# EAGLE design blinkyBoard (EAGLE 9.6.2)
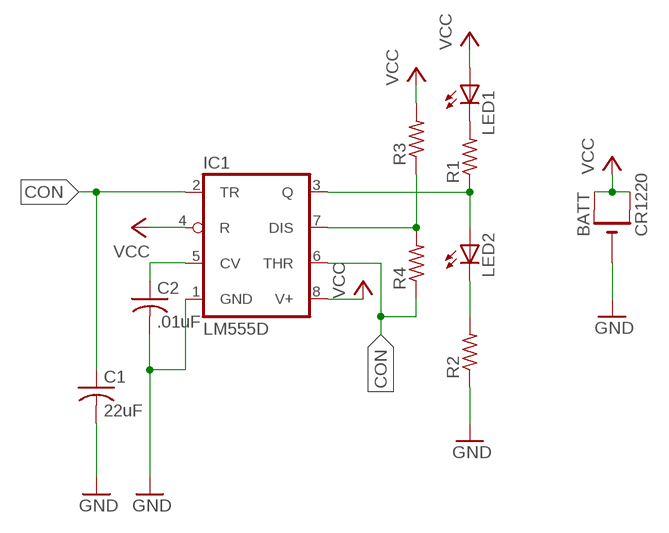
[diagram p0: schematic, sheet 1]

## Parts
BATT  CR1220  CR1220SMT  [CR1220-SMD]
C1  22uF  C-USC0805  [C0805]
C2  .01uF  C-USC0805  [C0805]
IC1  LM555D  [SO08]
LED1  LEDCHIP-LED0805  [CHIP-LED0805]
LED2  LEDCHIP-LED0805  [CHIP-LED0805]
R1  R-US_R0805  [R0805]
R2  R-US_R0805  [R0805]
R3  R-US_R0805  [R0805]
R4  R-US_R0805  [R0805]

## Nets
CON: C1.1 IC1.2(TR) IC1.6(THR) R4.1
GND: BATT.- C1.2 C2.2 IC1.1(GND) R2.1
N$1: LED1.C R1.2
N$2: IC1.3(Q) LED2.A R1.1
N$3: LED2.C R2.2
N$6: IC1.7(DIS) R3.1 R4.2
N$7: C2.1 IC1.5(CV)
VCC: BATT.+$1(+) BATT.+$2(+1) IC1.4(R) IC1.8(V+) LED1.A R3.2

## Library data of the parts
BATT = adafruit:CR1220: CR1216/CR1220/CR1225 12mm 3V lithium coin cell Great for battery packup. Both SMT and THM holders. Note the THM package has the ground pads on both sides of the PCB so that the masks are the same - this reduces the cost; MF: HARWIN; MPN: S8201-46R; OC_NEWARK: 65T3841
C1 = adafruit:C-US: CAPACITOR, American symbol; MF: MURATA; MPN: GRM21BR60J226ME39L; OC_NEWARK: 03AC2714
C2 = adafruit:C-US: CAPACITOR, American symbol; MF: KEMET; MPN: C0805C103K5RACTU; OC_NEWARK: 01J3314
IC1 = adafruit:*555: TIMER Changed DIP package to have round (not oval) pin pads http://www.ladyada.net/library/pcb/eaglelibrary.html; MF: TEXAS INSTRUMENTS; MPN: TLC555CD; OC_NEWARK: 29AH7834
LED1 LED2 = adafruit:LED: LED OSRAM: - CHIPLED LG R971, LG N971, LY N971, LG Q971, LY Q971, LO R971, LY R971 LH N974, LH R974 LS Q976, LO Q976, LY Q976 LO Q996 - Hyper CHIPLED LW Q18S LB Q993, LB Q99A, LB R99A - SideLED LS A670, LO A670, LY A670, LG A670, LP A670 LB A673, LV A673, LT A673, LW A673 LH A674 LY A675 LS A676, LA A676, LO A676, LY A676, LW A676 LS A679, LY A679, LG A679 - Hyper Micro SIDELED® LS Y876, LA Y876, LO Y876, LY Y876 LT Y87S - SmartLED LW L88C, LW L88S LB L89C, LB L89S, LG L890 LS L89K, LO L89K, LY L89K LS L896, LA L896, LO L896, LY L896 - TOPLED LS T670, LO T670, LY T670, LG T670, LP T670 LSG T670, LSP T670, LSY T670, LOP T670, LYG T670 LG T671, LOG T671, LSG T671 LB T673, LV T673, LT T673, LW T673 LH T674 LS T676, LA T676, LO T676, LY T676, LB T676, LH T676, LSB T676, LW T676 LB T67C, LV T67C, LT T67C, LS T67K, LO T67K, LY T67K, LW E67C LS E67B, LA E67B, LO E67B, LY E67B, LB E67C, LV E67C, LT E67C LW T67C LS T679, LY T679, LG T679 LS T770, LO T770, LY T770, LG T770, LP T770 LB T773, LV T773, LT T773, LW T773 LH T774 LS E675, LA E675, LY E675, LS T675 LS T776, LA T776, LO T776, LY T776, LB T776 LHGB T686 LT T68C, LB T68C - Hyper Mini TOPLED® LB M676 - Mini TOPLED Santana® LG M470 LS M47K, LO M47K, LY M47K Source: http://www.osram.convergy.de/; MF: LUMEX; MPN: SML-LX0805SGC-TR; OC_NEWARK: 09J9651
R1-R4 = adafruit:R-US_: RESISTOR, American symbol; MF: VISHAY; MPN: CRCW0805100RJNEA; OC_NEWARK: 01H7765

## Net classes
0 default: width 0.305 mm, drill 0.508 mm, clearance 0.254 mm

## Board
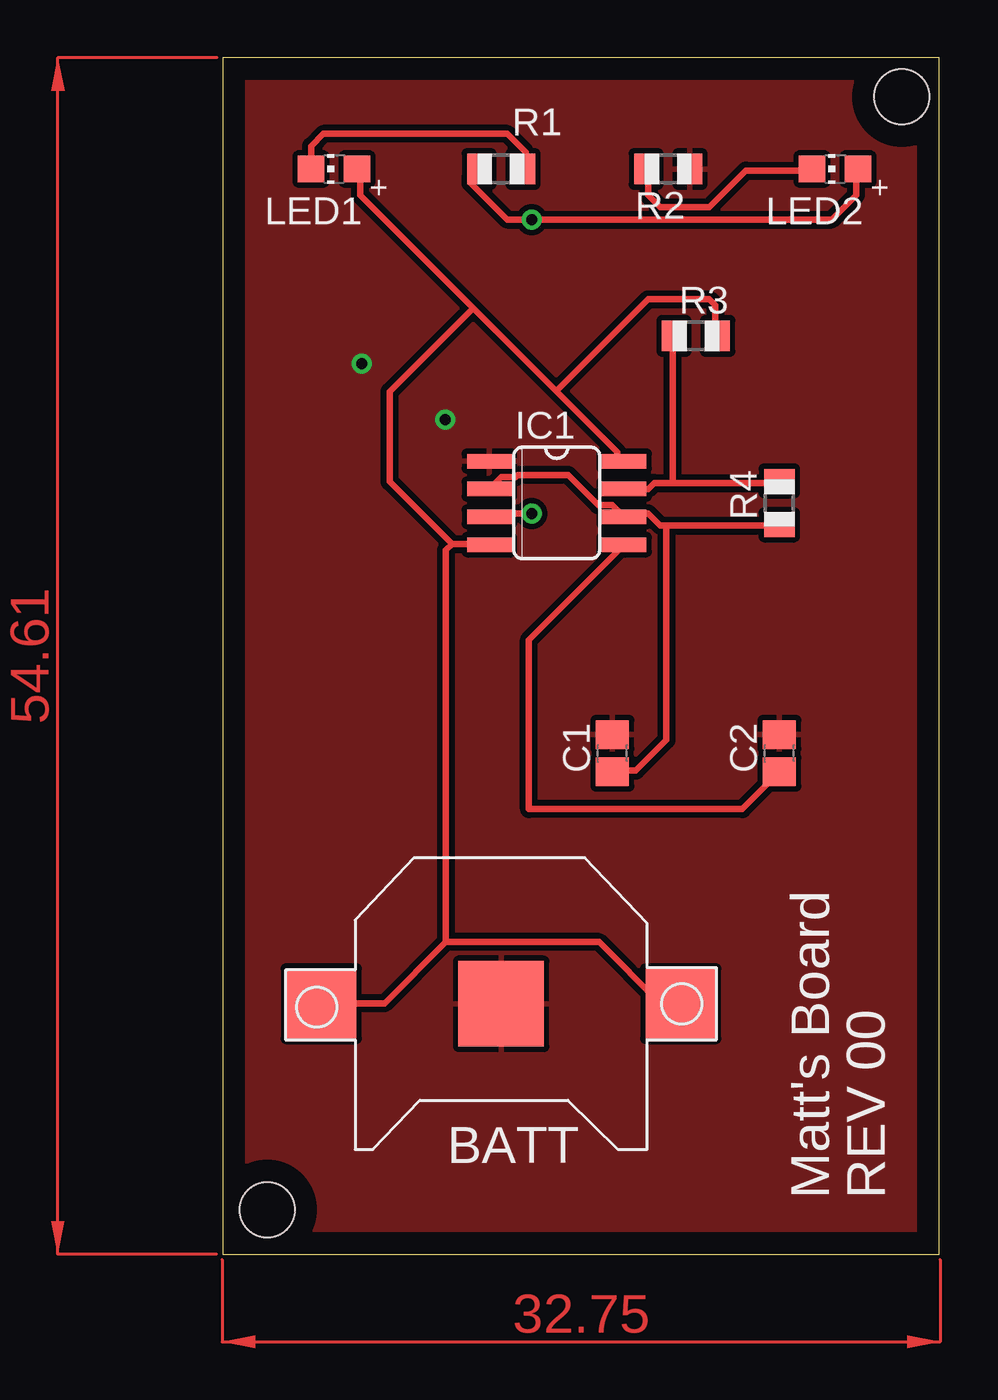
[diagram p1: board, top side]
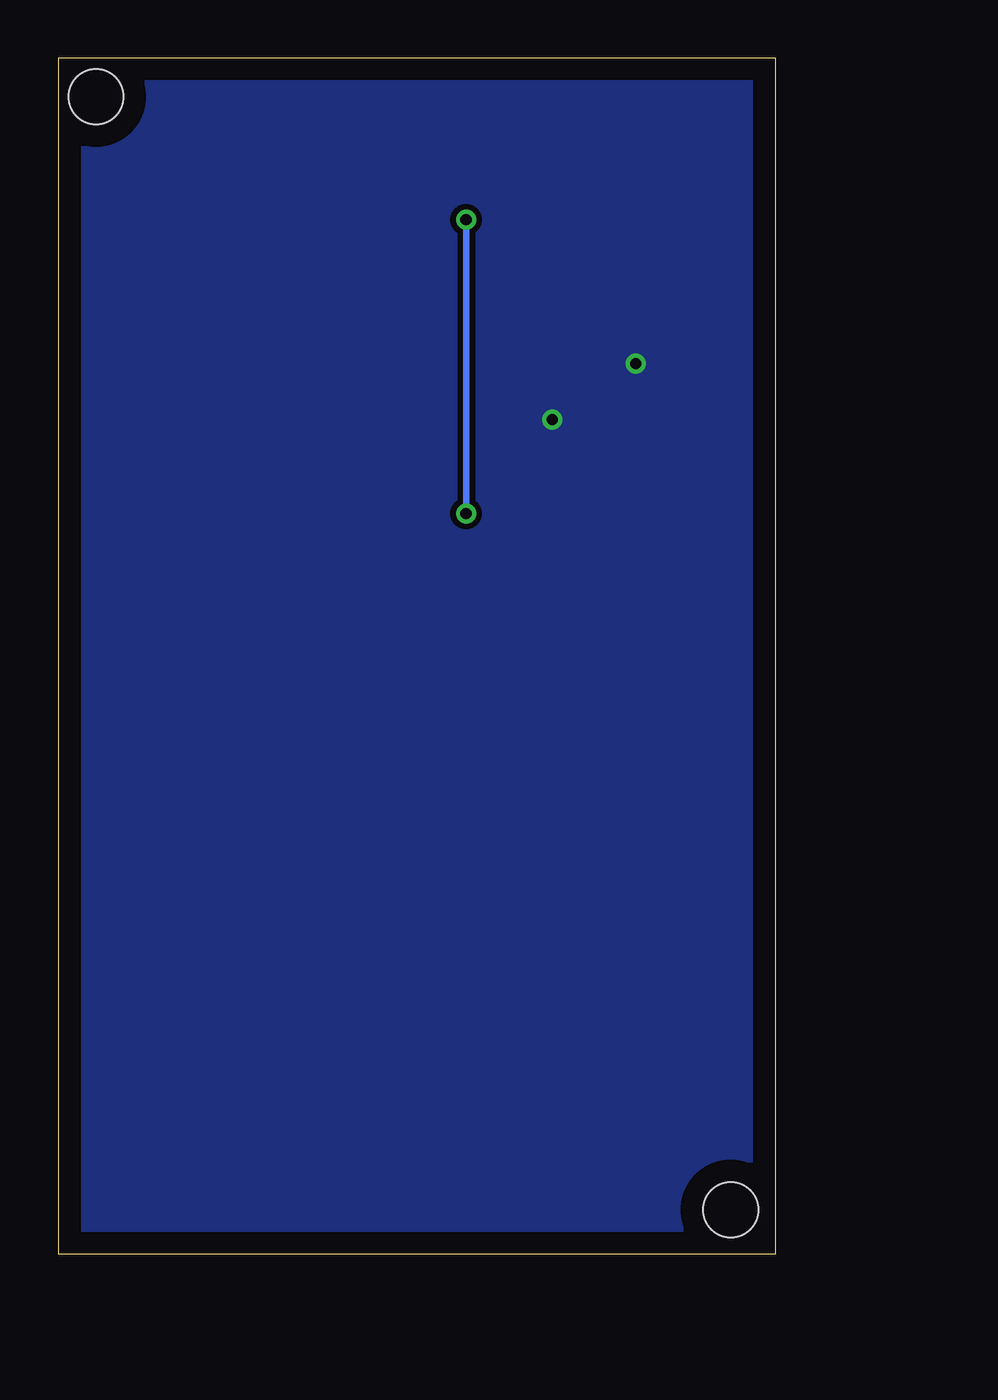
[diagram p2: board, bottom side, seen from below]

Size 32.69 x 54.6 mm. Coordinates in mm from the lower left corner, seen from the top.
Outline: 0,0 32.69,0 32.69,54.6 0,54.6 0,0
Copper layers (1*16): Top 0.035mm / dielectric 1.5mm / Bottom 0.035mm
Design rules "default": minimum track width 6mil, minimum drill 0.35mm, track to track 6mil, track to pad 6mil, pad to pad 6mil, via to via 6mil, smd to smd 6mil, copper to edge 40mil, drill to drill 6mil, minimum pad ring 10mil, minimum via ring 8mil, stop-mask expansion 4mil, vias tented up to drill 0mil, thermal gap 10mil
Holes 2.5 mm at 2.03,2.03 30.98,52.82

### Footprints (pad centres in the part's own frame; a part is rotated, then mirrored left to right if it is on the bottom)
CR1220-SMD = smd 3.2 x 3.2: +$1 -8.2,0; +$2 8.2,0 | smd 3.9 x 3.9: - 0,0
C0805 = smd 1.3 x 1.5: 1 -0.85,0; 2 0.85,0
SO08 = smd 0.66 x 2.032: 1 -1.905,-3.073; 2 -0.635,-3.073; 3 0.635,-3.073; 4 1.905,-3.073; 5 1.905,3.073; 6 0.635,3.073; 7 -0.635,3.073; 8 -1.905,3.073
CHIP-LED0805 = smd 1.2 x 1.2: A 0,-1.05; C 0,1.05
R0805 = smd 1.1 x 1.4: 1 -1,0; 2 1,0

### Placement (x,y rotation side)
BATT  12.7,11.43 180 top
C1  17.78,22.86 90 top
C2  25.4,22.86 90 top
IC1  15.24,34.29 270 top
LED1  5.08,49.53 90 top
LED2  27.94,49.53 90 top
R1  12.7,49.53 0 top
R2  20.32,49.53 180 top
R3  21.59,41.91 0 top
R4  25.4,34.29 90 top

### Tracks (layer width: path | path; a pad name or v marks a point on that pad's centre or on a via)
CON
  Top 0.305: 20.24,33.25 19.96,33.25 19.41,33.81 18.57,33.81 IC1.6 17.78,34.19 17.13,34.19 15.76,35.56 13.45,35.56 13.35,35.46 12.7,35.46 IC1.2 | 20.24,33.25 25.27,33.25 R4.1 | 20.24,33.25 20.24,23.47 18.85,22.07 18.01,22.07 C1.1
GND  (via drill 0.51)
  other vias: 6.35,40.64 10.16,38.1
  pour Top: -1.27,55.88 -1.27,-1.27 34.29,-1.27 34.29,55.88
  pour Bottom: -1.27,55.88 -1.27,-2.54 34.29,-2.54 34.29,55.88
N$1
  Top 0.305: LED1.C 4.04,49.73 4.04,50.57 4.6,51.13 12.98,51.13 13.82,50.29 13.82,49.73 R1.2
N$2  (via drill 0.51)
  Top 0.305: LED2.A 28.91,49.45 28.91,48.34 27.79,47.22 v14.1,47.22 12.98,47.22 11.3,48.9 11.3,49.17 11.58,49.45 R1.1 | v14.1,33.81 12.42,33.81 IC1.3
  Bottom 0.305: v14.1,47.22 v14.1,33.81
N$3
  Top 0.305: LED2.C 26.67,49.45 23.88,49.45 22.2,47.78 19.96,47.78 19.41,48.34 19.41,49.45 R2.2
N$6
  Top 0.305: 20.52,35.2 19.68,35.2 19.41,34.92 IC1.7 | 20.52,35.2 25.27,35.2 R4.2 | 20.52,35.2 20.52,41.91 R3.1
N$7
  Top 0.305: C2.1 23.71,20.32 13.97,20.32 13.97,28.04 IC1.5
VCC
  Top 0.305: 10.19,14.25 7.39,11.46 4.6,11.46 BATT.+$2 | 10.19,14.25 17.17,14.25 19.96,11.46 20.8,11.46 BATT.+$1 | 15.21,39.4 18.01,36.6 18.01,36.32 18.29,36.04 IC1.8 | 15.21,39.4 11.43,43.18 | 11.43,43.18 6.27,48.34 6.27,49.45 LED1.A | 15.21,39.4 19.41,43.59 22.2,43.59 22.48,43.31 22.48,41.91 R3.2 | 10.46,32.41 12.14,32.41 IC1.4 | 10.19,14.25 10.19,32.13 10.46,32.41 | 11.43,43.18 7.62,39.37 7.62,35.26 10.46,32.41
(copper drawn outside any net)
  shapes: Top area x2

### Text on the board
tPlace: Matt's Board | REV 00